# EAGLE design slink (EAGLE 5.11)

## Sheet 1 of 2
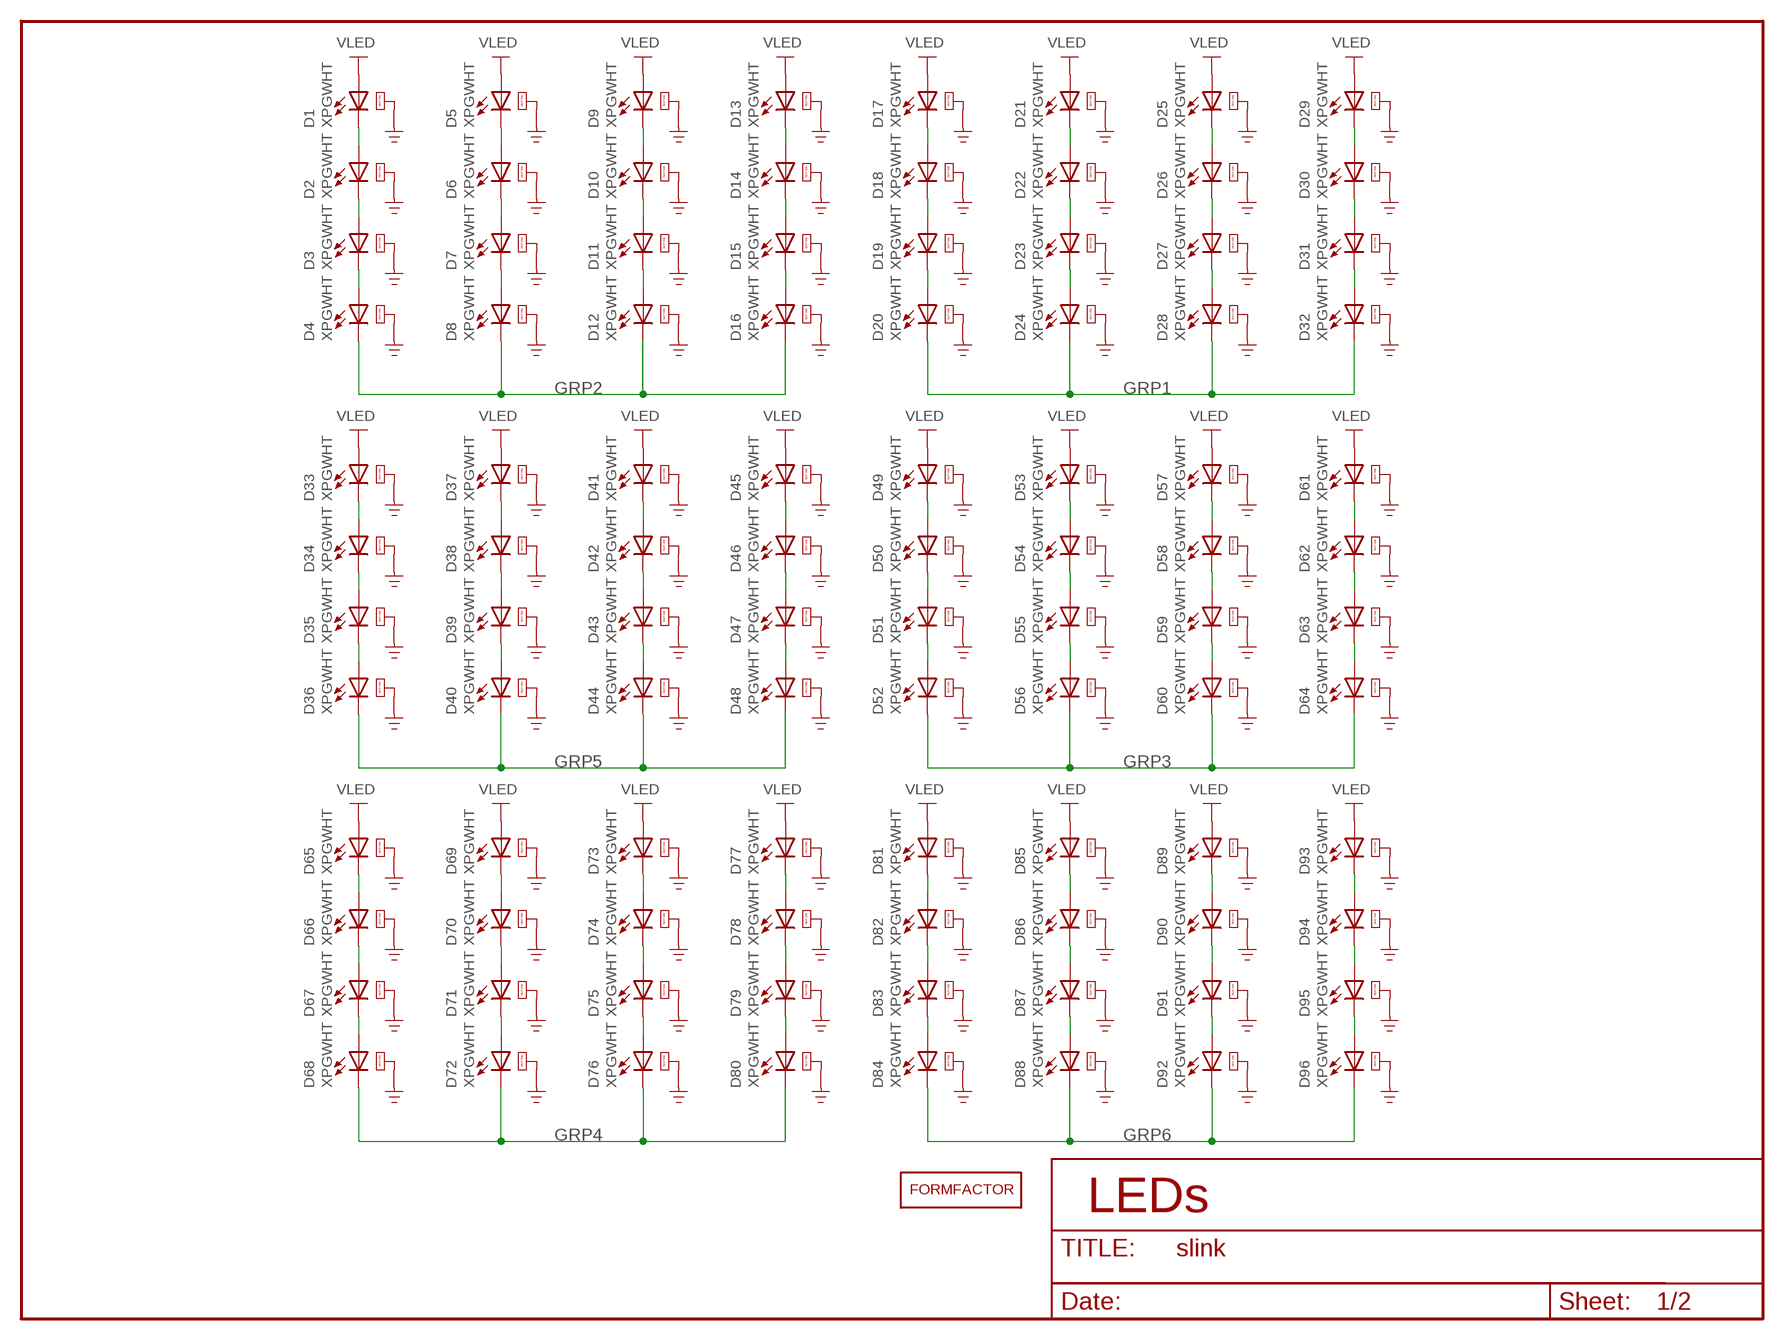
[diagram p0: schematic, sheet 1]

### Parts
D1  XPGWHT  [XLAMP_XP-G]
D2  XPGWHT  [XLAMP_XP-G]
D3  XPGWHT  [XLAMP_XP-G]
D4  XPGWHT  [XLAMP_XP-G]
D5  XPGWHT  [XLAMP_XP-G]
D6  XPGWHT  [XLAMP_XP-G]
D7  XPGWHT  [XLAMP_XP-G]
D8  XPGWHT  [XLAMP_XP-G]
D9  XPGWHT  [XLAMP_XP-G]
D10  XPGWHT  [XLAMP_XP-G]
D11  XPGWHT  [XLAMP_XP-G]
D12  XPGWHT  [XLAMP_XP-G]
D13  XPGWHT  [XLAMP_XP-G]
D14  XPGWHT  [XLAMP_XP-G]
D15  XPGWHT  [XLAMP_XP-G]
D16  XPGWHT  [XLAMP_XP-G]
D17  XPGWHT  [XLAMP_XP-G]
D18  XPGWHT  [XLAMP_XP-G]
D19  XPGWHT  [XLAMP_XP-G]
D20  XPGWHT  [XLAMP_XP-G]
D21  XPGWHT  [XLAMP_XP-G]
D22  XPGWHT  [XLAMP_XP-G]
D23  XPGWHT  [XLAMP_XP-G]
D24  XPGWHT  [XLAMP_XP-G]
D25  XPGWHT  [XLAMP_XP-G]
D26  XPGWHT  [XLAMP_XP-G]
D27  XPGWHT  [XLAMP_XP-G]
D28  XPGWHT  [XLAMP_XP-G]
D29  XPGWHT  [XLAMP_XP-G]
D30  XPGWHT  [XLAMP_XP-G]
D31  XPGWHT  [XLAMP_XP-G]
D32  XPGWHT  [XLAMP_XP-G]
D33  XPGWHT  [XLAMP_XP-G]
D34  XPGWHT  [XLAMP_XP-G]
D35  XPGWHT  [XLAMP_XP-G]
D36  XPGWHT  [XLAMP_XP-G]
D37  XPGWHT  [XLAMP_XP-G]
D38  XPGWHT  [XLAMP_XP-G]
D39  XPGWHT  [XLAMP_XP-G]
D40  XPGWHT  [XLAMP_XP-G]
D41  XPGWHT  [XLAMP_XP-G]
D42  XPGWHT  [XLAMP_XP-G]
D43  XPGWHT  [XLAMP_XP-G]
D44  XPGWHT  [XLAMP_XP-G]
D45  XPGWHT  [XLAMP_XP-G]
D46  XPGWHT  [XLAMP_XP-G]
D47  XPGWHT  [XLAMP_XP-G]
D48  XPGWHT  [XLAMP_XP-G]
D49  XPGWHT  [XLAMP_XP-G]
D50  XPGWHT  [XLAMP_XP-G]
D51  XPGWHT  [XLAMP_XP-G]
D52  XPGWHT  [XLAMP_XP-G]
D53  XPGWHT  [XLAMP_XP-G]
D54  XPGWHT  [XLAMP_XP-G]
D55  XPGWHT  [XLAMP_XP-G]
D56  XPGWHT  [XLAMP_XP-G]
D57  XPGWHT  [XLAMP_XP-G]
D58  XPGWHT  [XLAMP_XP-G]
D59  XPGWHT  [XLAMP_XP-G]
D60  XPGWHT  [XLAMP_XP-G]
D61  XPGWHT  [XLAMP_XP-G]
D62  XPGWHT  [XLAMP_XP-G]
D63  XPGWHT  [XLAMP_XP-G]
D64  XPGWHT  [XLAMP_XP-G]
D65  XPGWHT  [XLAMP_XP-G]
D66  XPGWHT  [XLAMP_XP-G]
D67  XPGWHT  [XLAMP_XP-G]
D68  XPGWHT  [XLAMP_XP-G]
D69  XPGWHT  [XLAMP_XP-G]
D70  XPGWHT  [XLAMP_XP-G]
D71  XPGWHT  [XLAMP_XP-G]
D72  XPGWHT  [XLAMP_XP-G]
D73  XPGWHT  [XLAMP_XP-G]
D74  XPGWHT  [XLAMP_XP-G]
D75  XPGWHT  [XLAMP_XP-G]
D76  XPGWHT  [XLAMP_XP-G]
D77  XPGWHT  [XLAMP_XP-G]
D78  XPGWHT  [XLAMP_XP-G]
D79  XPGWHT  [XLAMP_XP-G]
D80  XPGWHT  [XLAMP_XP-G]
D81  XPGWHT  [XLAMP_XP-G]
D82  XPGWHT  [XLAMP_XP-G]
D83  XPGWHT  [XLAMP_XP-G]
D84  XPGWHT  [XLAMP_XP-G]
D85  XPGWHT  [XLAMP_XP-G]
D86  XPGWHT  [XLAMP_XP-G]
D87  XPGWHT  [XLAMP_XP-G]
D88  XPGWHT  [XLAMP_XP-G]
D89  XPGWHT  [XLAMP_XP-G]
D90  XPGWHT  [XLAMP_XP-G]
D91  XPGWHT  [XLAMP_XP-G]
D92  XPGWHT  [XLAMP_XP-G]
D93  XPGWHT  [XLAMP_XP-G]
D94  XPGWHT  [XLAMP_XP-G]
D95  XPGWHT  [XLAMP_XP-G]
D96  XPGWHT  [XLAMP_XP-G]
FORMFACTOR1  FORMFACTOR  [SINGLECHANNELSTROBE]

### Nets
GND: D1.HEAT(HEATSINK) D2.HEAT(HEATSINK) D3.HEAT(HEATSINK) D4.HEAT(HEATSINK) D5.HEAT(HEATSINK) D6.HEAT(HEATSINK) D7.HEAT(HEATSINK) D8.HEAT(HEATSINK) D9.HEAT(HEATSINK) D10.HEAT(HEATSINK) D11.HEAT(HEATSINK) D12.HEAT(HEATSINK) D13.HEAT(HEATSINK) D14.HEAT(HEATSINK) D15.HEAT(HEATSINK) D16.HEAT(HEATSINK) D17.HEAT(HEATSINK) D18.HEAT(HEATSINK) D19.HEAT(HEATSINK) D20.HEAT(HEATSINK) D21.HEAT(HEATSINK) D22.HEAT(HEATSINK) D23.HEAT(HEATSINK) D24.HEAT(HEATSINK) D25.HEAT(HEATSINK) D26.HEAT(HEATSINK) D27.HEAT(HEATSINK) D28.HEAT(HEATSINK) D29.HEAT(HEATSINK) D30.HEAT(HEATSINK) D31.HEAT(HEATSINK) D32.HEAT(HEATSINK) D33.HEAT(HEATSINK) D34.HEAT(HEATSINK) D35.HEAT(HEATSINK) D36.HEAT(HEATSINK) D37.HEAT(HEATSINK) D38.HEAT(HEATSINK) D39.HEAT(HEATSINK) D40.HEAT(HEATSINK) D41.HEAT(HEATSINK) D42.HEAT(HEATSINK) D43.HEAT(HEATSINK) D44.HEAT(HEATSINK) D45.HEAT(HEATSINK) D46.HEAT(HEATSINK) D47.HEAT(HEATSINK) D48.HEAT(HEATSINK) D49.HEAT(HEATSINK) D50.HEAT(HEATSINK) D51.HEAT(HEATSINK) D52.HEAT(HEATSINK) D53.HEAT(HEATSINK) D54.HEAT(HEATSINK) D55.HEAT(HEATSINK) D56.HEAT(HEATSINK) D57.HEAT(HEATSINK) D58.HEAT(HEATSINK) D59.HEAT(HEATSINK) D60.HEAT(HEATSINK) D61.HEAT(HEATSINK) D62.HEAT(HEATSINK) D63.HEAT(HEATSINK) D64.HEAT(HEATSINK) D65.HEAT(HEATSINK) D66.HEAT(HEATSINK) D67.HEAT(HEATSINK) D68.HEAT(HEATSINK) D69.HEAT(HEATSINK) D70.HEAT(HEATSINK) D71.HEAT(HEATSINK) D72.HEAT(HEATSINK) D73.HEAT(HEATSINK) D74.HEAT(HEATSINK) D75.HEAT(HEATSINK) D76.HEAT(HEATSINK) D77.HEAT(HEATSINK) D78.HEAT(HEATSINK) D79.HEAT(HEATSINK) D80.HEAT(HEATSINK) D81.HEAT(HEATSINK) D82.HEAT(HEATSINK) D83.HEAT(HEATSINK) D84.HEAT(HEATSINK) D85.HEAT(HEATSINK) D86.HEAT(HEATSINK) D87.HEAT(HEATSINK) D88.HEAT(HEATSINK) D89.HEAT(HEATSINK) D90.HEAT(HEATSINK) D91.HEAT(HEATSINK) D92.HEAT(HEATSINK) D93.HEAT(HEATSINK) D94.HEAT(HEATSINK) D95.HEAT(HEATSINK) D96.HEAT(HEATSINK) ; also sheet 2
GRP1: D20.C D24.C D28.C D32.C ; also sheet 2
GRP2: D4.C D8.C D12.C D16.C ; also sheet 2
GRP3: D52.C D56.C D60.C D64.C ; also sheet 2
GRP4: D68.C D72.C D76.C D80.C ; also sheet 2
GRP5: D36.C D40.C D44.C D48.C ; also sheet 2
GRP6: D84.C D88.C D92.C D96.C ; also sheet 2
N$1: D1.C D2.A
N$2: D2.C D3.A
N$3: D3.C D4.A
N$4: D5.C D6.A
N$5: D6.C D7.A
N$6: D7.C D8.A
N$7: D9.C D10.A
N$8: D10.C D11.A
N$9: D11.C D12.A
N$10: D13.C D14.A
N$11: D14.C D15.A
N$12: D15.C D16.A
N$13: D17.C D18.A
N$14: D18.C D19.A
N$15: D19.C D20.A
N$16: D21.C D22.A
N$17: D22.C D23.A
N$18: D23.C D24.A
N$19: D25.C D26.A
N$20: D26.C D27.A
N$21: D27.C D28.A
N$22: D29.C D30.A
N$23: D30.C D31.A
N$24: D31.C D32.A
N$25: D33.C D34.A
N$26: D34.C D35.A
N$27: D35.C D36.A
N$28: D37.C D38.A
N$29: D38.C D39.A
N$30: D39.C D40.A
N$31: D41.C D42.A
N$32: D42.C D43.A
N$33: D43.C D44.A
N$34: D45.C D46.A
N$35: D46.C D47.A
N$36: D47.C D48.A
N$37: D49.C D50.A
N$38: D50.C D51.A
N$39: D51.C D52.A
N$40: D53.C D54.A
N$41: D54.C D55.A
N$42: D55.C D56.A
N$43: D57.C D58.A
N$44: D58.C D59.A
N$45: D59.C D60.A
N$46: D61.C D62.A
N$47: D62.C D63.A
N$48: D63.C D64.A
N$49: D65.C D66.A
N$50: D66.C D67.A
N$51: D67.C D68.A
N$52: D69.C D70.A
N$53: D70.C D71.A
N$54: D71.C D72.A
N$55: D73.C D74.A
N$56: D74.C D75.A
N$57: D75.C D76.A
N$58: D77.C D78.A
N$59: D78.C D79.A
N$60: D79.C D80.A
N$61: D81.C D82.A
N$62: D82.C D83.A
N$63: D83.C D84.A
N$64: D85.C D86.A
N$65: D86.C D87.A
N$66: D87.C D88.A
N$67: D89.C D90.A
N$68: D90.C D91.A
N$69: D91.C D92.A
N$70: D93.C D94.A
N$71: D94.C D95.A
N$72: D95.C D96.A
VLED: D1.A D5.A D9.A D13.A D17.A D21.A D25.A D29.A D33.A D37.A D41.A D45.A D49.A D53.A D57.A D61.A D65.A D69.A D73.A D77.A D81.A D85.A D89.A D93.A ; also sheet 2

### Notes on the sheet
- LEDs

## Sheet 2 of 2
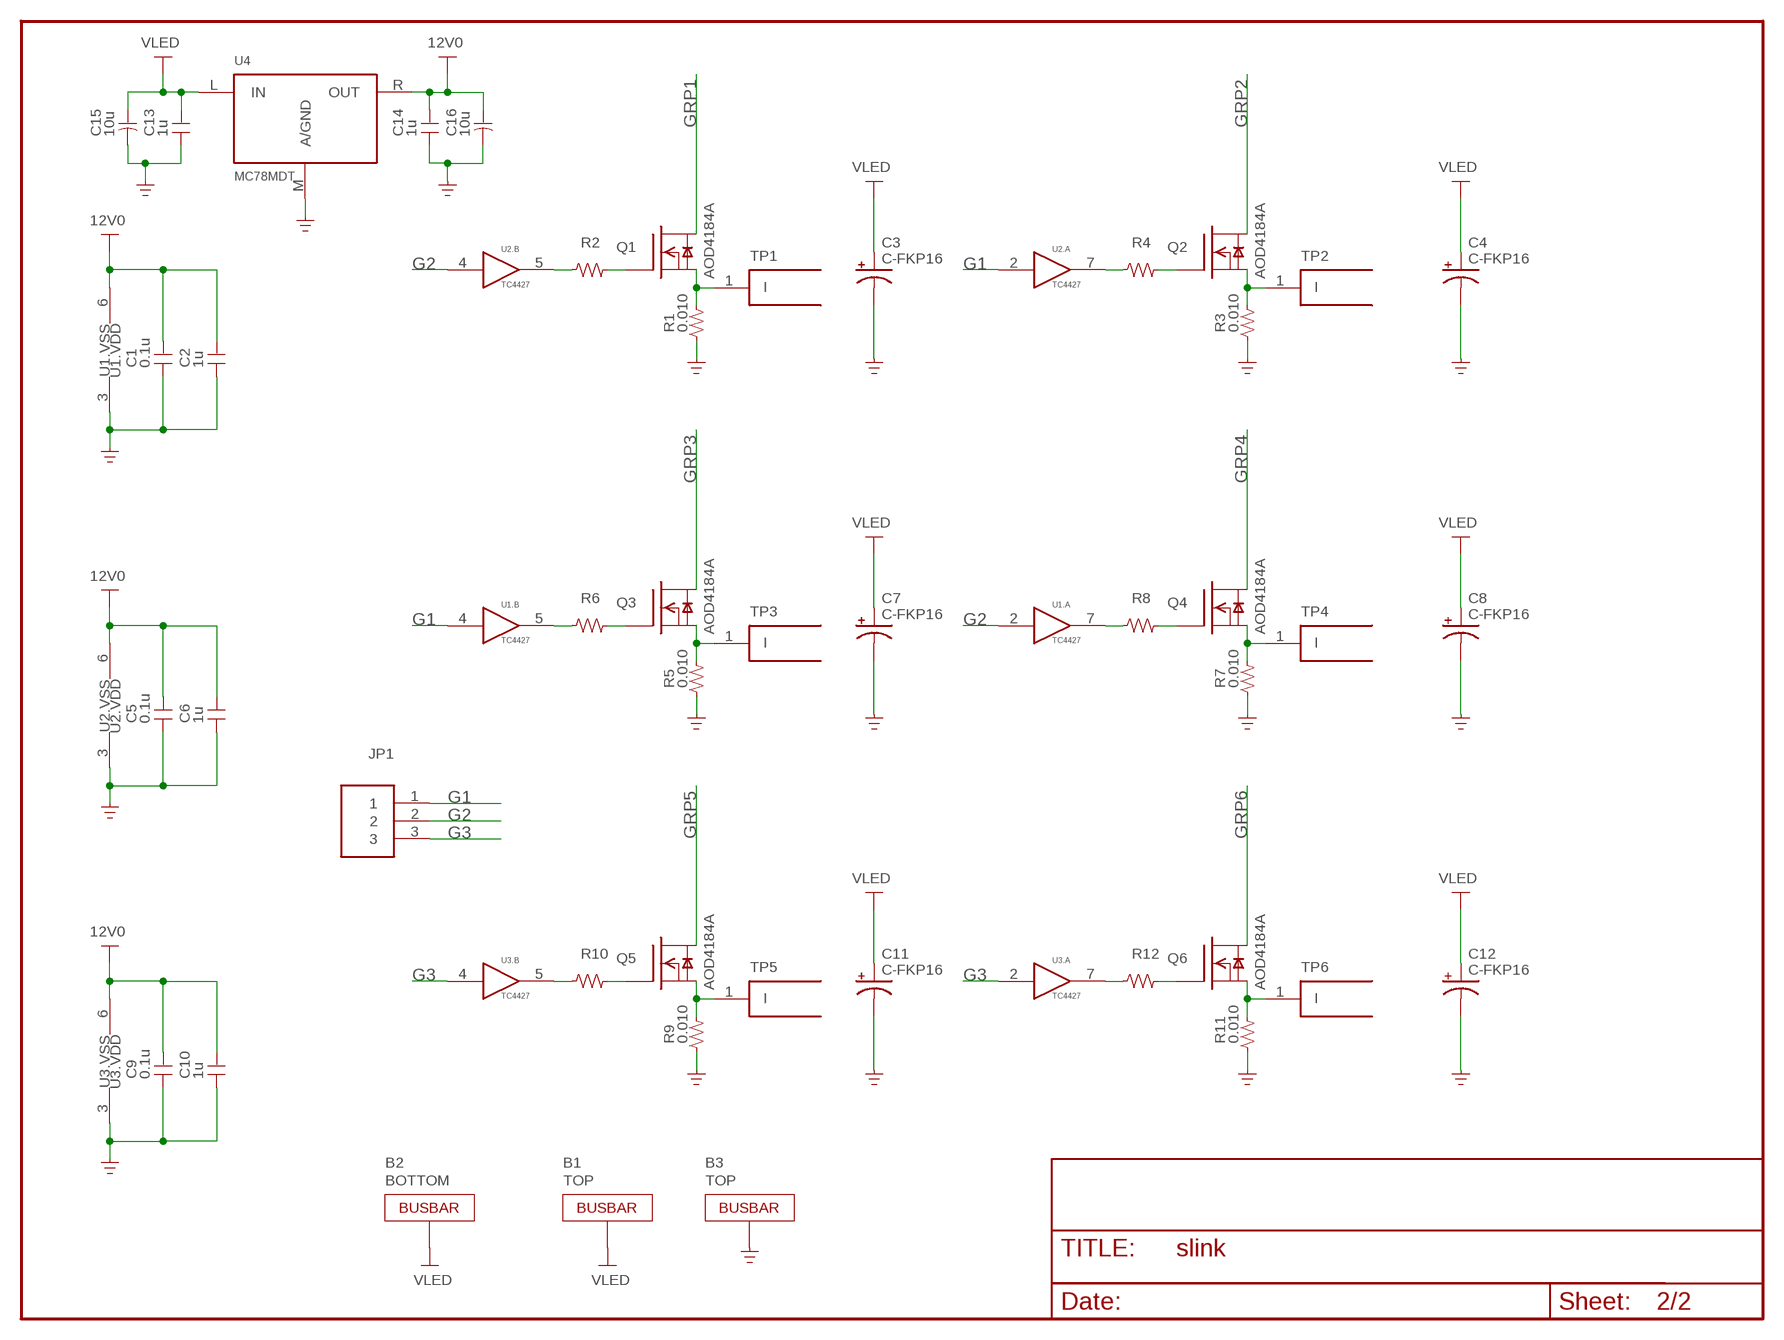
[diagram p1: schematic, sheet 2]

### Parts
B1  TOP  BUSBAR  [BUSBAR]
B2  BOTTOM  BUSBAR  [BUSBAR]
B3  TOP  BUSBAR-1LAYER  [BUSBAR-1LAYER]
C1  0.1u  C-0603  [SMD0603]
C2  1u  C-0603  [SMD0603]
C3  C-FKP16  [EEV-FK-P16]
C4  C-FKP16  [EEV-FK-P16]
C5  0.1u  C-0603  [SMD0603]
C6  1u  C-0603  [SMD0603]
C7  C-FKP16  [EEV-FK-P16]
C8  C-FKP16  [EEV-FK-P16]
C9  0.1u  C-0603  [SMD0603]
C10  1u  C-0603  [SMD0603]
C11  C-FKP16  [EEV-FK-P16]
C12  C-FKP16  [EEV-FK-P16]
C13  1u  C-0603  [SMD0603]
C14  1u  C-0603  [SMD0603]
C15  10u  C-POL-6032  [CT6032]
C16  10u  C-POL-6032  [CT6032]
JP1  CONN-3  [1X3]
Q1  AOD4184A  [TO252]
Q2  AOD4184A  [TO252]
Q3  AOD4184A  [TO252]
Q4  AOD4184A  [TO252]
Q5  AOD4184A  [TO252]
Q6  AOD4184A  [TO252]
R1  0.010  R-3.2X1.6MM  [3.2X1.6MM]
R2  R-0603  [SMD0603]
R3  0.010  R-3.2X1.6MM  [3.2X1.6MM]
R4  R-0603  [SMD0603]
R5  0.010  R-3.2X1.6MM  [3.2X1.6MM]
R6  R-0603  [SMD0603]
R7  0.010  R-3.2X1.6MM  [3.2X1.6MM]
R8  R-0603  [SMD0603]
R9  0.010  R-3.2X1.6MM  [3.2X1.6MM]
R10  R-0603  [SMD0603]
R11  0.010  R-3.2X1.6MM  [3.2X1.6MM]
R12  R-0603  [SMD0603]
TP1  I  TP-HOLE  [TP-HOLE]
TP2  I  TP-HOLE  [TP-HOLE]
TP3  I  TP-HOLE  [TP-HOLE]
TP4  I  TP-HOLE  [TP-HOLE]
TP5  I  TP-HOLE  [TP-HOLE]
TP6  I  TP-HOLE  [TP-HOLE]
U1  TC4427  [SOIC8]
U2  TC4427  [SOIC8]
U3  TC4427  [SOIC8]
U4  MC78MDT  [TO252]

### Nets
12V0: C1.2 C2.2 C5.2 C6.2 C9.2 C10.2 C14.2 C16.+ U1.6(.VDD:VDD) U2.6(.VDD:VDD) U3.6(.VDD:VDD) U4.R(OUT)
G1: JP1.1 U1.4(.B:I) U2.2(.A:I)
G2: JP1.2 U1.2(.A:I) U2.4(.B:I)
G3: JP1.3 U3.2(.A:I) U3.4(.B:I)
GND: B3.1 C1.1 C2.1 C3.1(-) C4.1(-) C5.1 C6.1 C7.1(-) C8.1(-) C9.1 C10.1 C11.1(-) C12.1(-) C13.1 C14.1 C15.- C16.- R1.1 R3.1 R5.1 R7.1 R9.1 R11.1 U1.3(.VSS:VSS) U2.3(.VSS:VSS) U3.3(.VSS:VSS) U4.M(A/GND) ; also sheet 1
GRP1: Q1.M(D) ; also sheet 1
GRP2: Q2.M(D) ; also sheet 1
GRP3: Q3.M(D) ; also sheet 1
GRP4: Q4.M(D) ; also sheet 1
GRP5: Q5.M(D) ; also sheet 1
GRP6: Q6.M(D) ; also sheet 1
N$73: Q1.R(S) R1.2 TP1.1
N$74: Q1.L(G) R2.2
N$75: R2.1 U2.5(.B:O)
N$79: Q2.R(S) R3.2 TP2.1
N$80: Q2.L(G) R4.2
N$81: R4.1 U2.7(.A:O)
N$85: Q3.R(S) R5.2 TP3.1
N$86: Q3.L(G) R6.2
N$87: R6.1 U1.5(.B:O)
N$91: Q4.R(S) R7.2 TP4.1
N$92: Q4.L(G) R8.2
N$93: R8.1 U1.7(.A:O)
N$97: Q5.R(S) R9.2 TP5.1
N$98: Q5.L(G) R10.2
N$99: R10.1 U3.5(.B:O)
N$103: Q6.R(S) R11.2 TP6.1
N$104: Q6.L(G) R12.2
N$105: R12.1 U3.7(.A:O)
VLED: B1.1 B2.1 C3.2(+) C4.2(+) C7.2(+) C8.2(+) C11.2(+) C12.2(+) C13.2 C15.+ U4.L(IN) ; also sheet 1
Unconnected: U1.1(NC) U1.8(NC) U2.1(NC) U2.8(NC) U3.1(NC) U3.8(NC)

## Library data of the parts
B1-B3 = parts:BUSBAR
C1 C2 C5 C6 C9 C10 C13 C14 = parts:C
C3 C4 C7 C8 C11 C12 = parts:C-
C15 C16 = parts:C-POL
D1-D96 = parts:XPGWHT
FORMFACTOR1 = parts-mar:FORMFACTOR
JP1 = parts:CONN-3
Q1-Q6 = parts:AOD4184A
R1-R12 = parts:R
TP1-TP6 = parts:TP
U1-U3 = parts:TC4427
U4 = parts:MC78M*

## Board
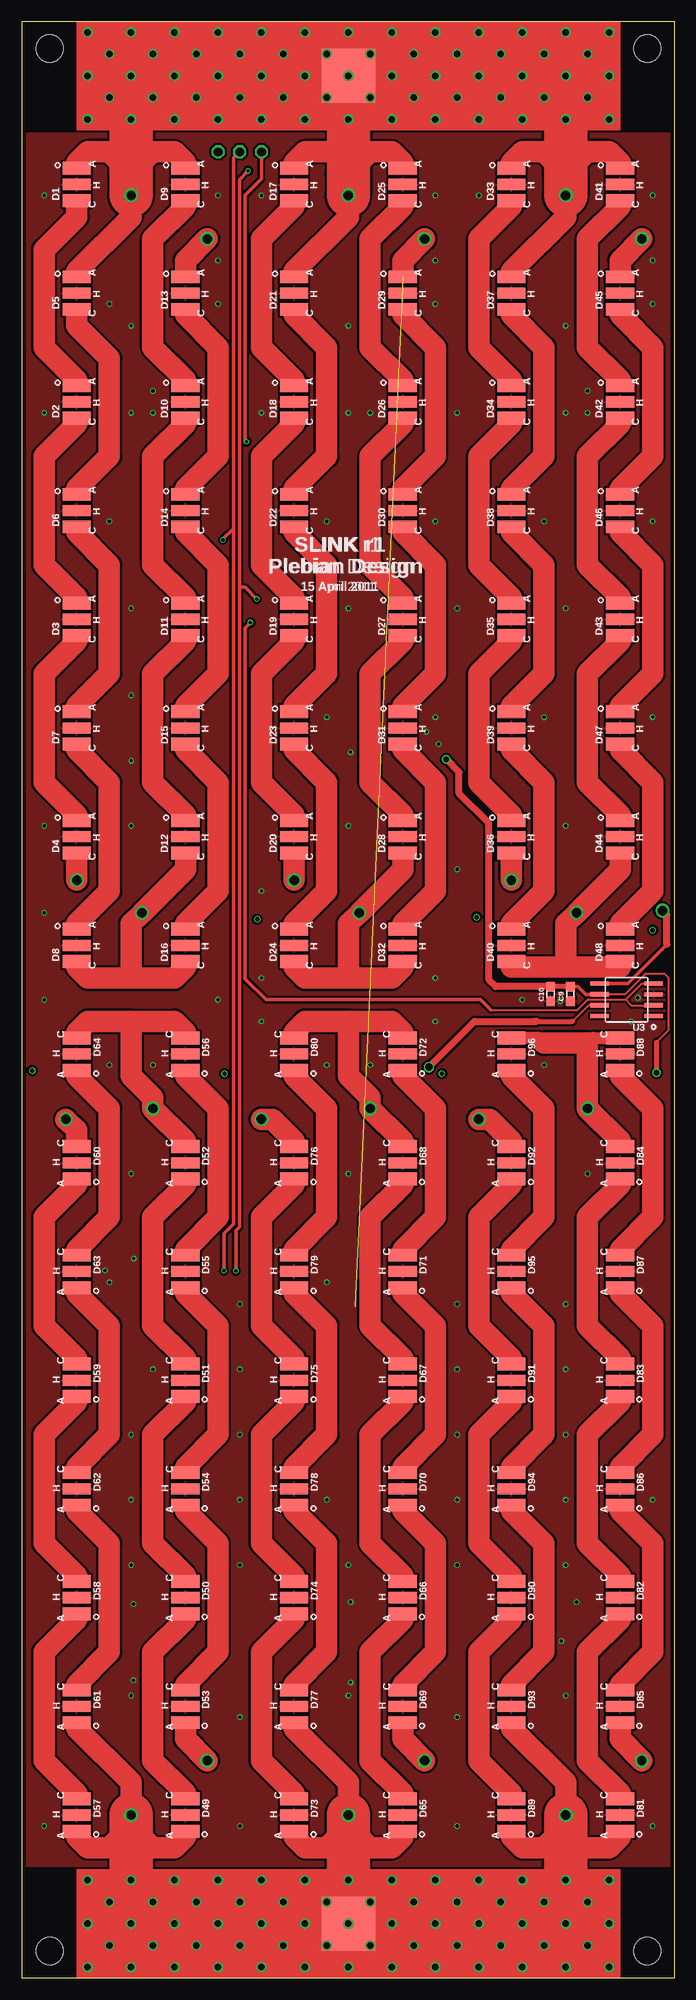
[diagram p2: board, top side]
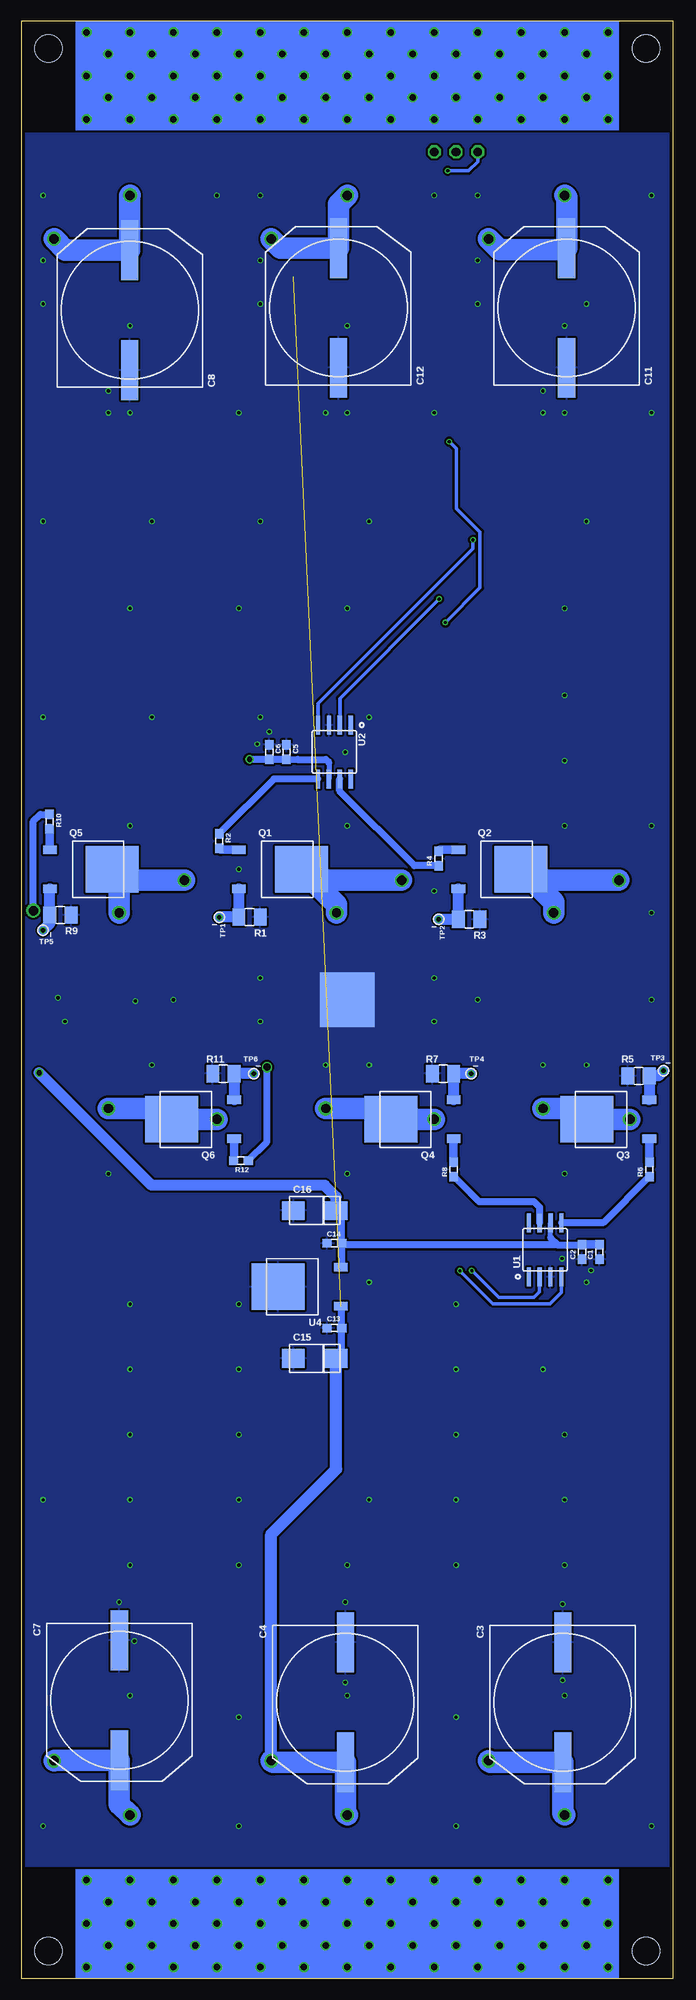
[diagram p3: board, bottom side, seen from below]

Size 76.2 x 228.6 mm. Coordinates in mm from the lower left corner, seen from the top.
Copper layers (1*16): Top 0.0356mm / dielectric 1.5011mm / Bottom 0.0356mm
Design rules "33each *": minimum track width 6mil, minimum drill 15mil, track to track 6mil, track to pad 6mil, pad to pad 6mil, via to via 6mil, smd to smd 6mil, copper to edge 15mil, drill to drill 10mil, minimum pad ring 5mil, minimum via ring 5mil, stop-mask expansion 4mil, vias tented up to drill 0mil, thermal gap 10mil

### Footprints (pad centres in the part's own frame; a part is rotated, then mirrored left to right if it is on the bottom)
BUSBAR = smd 6.35 x 6.35: 1 0,0 | drill 0.762 round: P$6 -30.48,0; P$7 -30.48,5.08; P$8 -30.48,-5.08; P$9 -27.94,2.54; P$10 -27.94,-2.54; P$11 -25.4,-5.08; P$12 -25.4,0; P$13 -25.4,5.08; P$14 -22.86,2.54; P$15 -22.86,-2.54; P$16 -20.32,5.08; P$17 -20.32,-5.08; P$18 -20.32,0; P$19 -17.78,2.54; P$20 -17.78,-2.54; P$21 -15.24,0; P$22 -15.24,5.08; P$23 -15.24,-5.08; P$24 -12.7,2.54; P$25 -12.7,-2.54; P$26 -10.16,-5.08; P$27 -10.16,0; P$28 -10.16,5.08; P$29 -7.62,2.54; P$30 -7.62,-2.54; P$31 -5.08,5.08; P$32 -5.08,-5.08; P$33 -5.08,0; P$34 -2.54,2.54; P$35 -2.54,-2.54; P$36 0,0; P$37 0,5.08; P$38 0,-5.08; P$39 2.54,2.54; P$40 2.54,-2.54; P$41 5.08,-5.08; P$42 5.08,0; P$43 5.08,5.08; P$44 7.62,2.54; P$45 7.62,-2.54; P$46 10.16,5.08; P$47 10.16,-5.08; P$48 10.16,0; P$49 12.7,2.54; P$50 12.7,-2.54; P$51 15.24,0; P$52 15.24,5.08; P$53 15.24,-5.08; P$54 17.78,2.54; P$55 17.78,-2.54; P$56 20.32,-5.08; P$57 20.32,0; P$58 20.32,5.08; P$59 22.86,2.54; P$60 22.86,-2.54; P$61 25.4,5.08; P$62 25.4,-5.08; P$63 25.4,0; P$64 27.94,2.54; P$65 27.94,-2.54; P$66 30.48,0; P$67 30.48,5.08; P$68 30.48,-5.08
BUSBAR-1LAYER = smd 6.35 x 6.35: 1 0,0
SMD0603 = smd 1.1 x 1: 1 -0.85,0; 2 0.85,0
EEV-FK-P16 = smd 7 x 2: 1 -10,-1.5; 2 4,-1.5
CT6032 = smd 2.6 x 2.2: + 2.5,0; - -2.5,0
XLAMP_XP-G = smd 1.5 x 3.3: A 1.898,0; C -1.898,0 | smd 1.3 x 3.3: HEAT 0,0
SINGLECHANNELSTROBE = hole 3.2: 3.175,-3.175; 73.025,-3.175; 3.175,-225.425; 73.025,-225.425
1X3 = drill 1.016 octagon: 1 0,2.54; 2 0,0; 3 0,-2.54
TO252 = smd 1 x 1.6: L -2.28,-4.8; R 2.28,-4.8 | smd 5.4 x 6.2: M 0,2.5
3.2X1.6MM = smd 1.5 x 2: 1 -1.25,0; 2 1.25,0
TP-HOLE = drill 0.508 round: 1 0,0
SOIC8 = smd 0.5 x 2.2: 1 -1.905,-3.154; 2 -0.645,-3.154; 3 0.625,-3.154; 4 1.895,-3.154; 5 1.905,3.154; 6 0.635,3.154; 7 -0.635,3.154; 8 -1.905,3.154

### Placement (x,y rotation side)
B1  38.1,222.25 0 top
B2  38.1,6.35 0 top
B3  38.1,114.3 0 bottom
C1  8.64,84.84 90 bottom
C2  10.67,84.84 90 bottom
C3  11.43,29.21 270 bottom
C4  36.83,29.21 270 bottom
C5  45.21,143.26 270 bottom
C6  47.24,143.26 270 bottom
C7  63.25,29.46 270 bottom
C8  65.02,197.87 90 bottom
C9  64.03,114.99 90 top
C10  61.72,114.99 90 top
C11  13.97,198.12 90 bottom
C12  40.64,198.12 90 bottom
C13  39.62,75.95 0 bottom
C14  39.62,85.85 0 bottom
C15  41.91,72.39 0 bottom
C16  41.91,89.66 0 bottom
D1  6.35,209.55 90 top
D2  6.35,184.15 90 top
D3  6.35,158.75 90 top
D4  6.35,133.35 90 top
D5  6.35,196.85 90 top
D6  6.35,171.45 90 top
D7  6.35,146.05 90 top
D8  6.35,120.65 90 top
D9  19.05,209.55 90 top
D10  19.05,184.15 90 top
D11  19.05,158.75 90 top
D12  19.05,133.35 90 top
D13  19.05,196.85 90 top
D14  19.05,171.45 90 top
D15  19.05,146.05 90 top
D16  19.05,120.65 90 top
D17  31.75,209.55 90 top
D18  31.75,184.15 90 top
D19  31.75,158.75 90 top
D20  31.75,133.35 90 top
D21  31.75,196.85 90 top
D22  31.75,171.45 90 top
D23  31.75,146.05 90 top
D24  31.75,120.65 90 top
D25  44.45,209.55 90 top
D26  44.45,184.15 90 top
D27  44.45,158.75 90 top
D28  44.45,133.35 90 top
D29  44.45,196.85 90 top
D30  44.45,171.45 90 top
D31  44.45,146.05 90 top
D32  44.45,120.65 90 top
D33  57.15,209.55 90 top
D34  57.15,184.15 90 top
D35  57.15,158.75 90 top
D36  57.15,133.35 90 top
D37  57.15,196.85 90 top
D38  57.15,171.45 90 top
D39  57.15,146.05 90 top
D40  57.15,120.65 90 top
D41  69.85,209.55 90 top
D42  69.85,184.15 90 top
D43  69.85,158.75 90 top
D44  69.85,133.35 90 top
D45  69.85,196.85 90 top
D46  69.85,171.45 90 top
D47  69.85,146.05 90 top
D48  69.85,120.65 90 top
D49  19.05,19.05 270 top
D50  19.05,44.45 270 top
D51  19.05,69.85 270 top
D52  19.05,95.25 270 top
D53  19.05,31.75 270 top
D54  19.05,57.15 270 top
D55  19.05,82.55 270 top
D56  19.05,107.95 270 top
D57  6.35,19.05 270 top
D58  6.35,44.45 270 top
D59  6.35,69.85 270 top
D60  6.35,95.25 270 top
D61  6.35,31.75 270 top
D62  6.35,57.15 270 top
D63  6.35,82.55 270 top
D64  6.35,107.95 270 top
D65  44.45,19.05 270 top
D66  44.45,44.45 270 top
D67  44.45,69.85 270 top
D68  44.45,95.25 270 top
D69  44.45,31.75 270 top
D70  44.45,57.15 270 top
D71  44.45,82.55 270 top
D72  44.45,107.95 270 top
D73  31.75,19.05 270 top
D74  31.75,44.45 270 top
D75  31.75,69.85 270 top
D76  31.75,95.25 270 top
D77  31.75,31.75 270 top
D78  31.75,57.15 270 top
D79  31.75,82.55 270 top
D80  31.75,107.95 270 top
D81  69.85,19.05 270 top
D82  69.85,44.45 270 top
D83  69.85,69.85 270 top
D84  69.85,95.25 270 top
D85  69.85,31.75 270 top
D86  69.85,57.15 270 top
D87  69.85,82.55 270 top
D88  69.85,107.95 270 top
D89  57.15,19.05 270 top
D90  57.15,44.45 270 top
D91  57.15,69.85 270 top
D92  57.15,95.25 270 top
D93  57.15,31.75 270 top
D94  57.15,57.15 270 top
D95  57.15,82.55 270 top
D96  57.15,107.95 270 top
FORMFACTOR1  0,228.6 0 top
JP1  25.4,213.36 90 top
Q1  45.97,129.54 270 bottom
Q2  20.32,129.54 270 bottom
Q3  7.62,100.33 90 bottom
Q4  30.48,100.33 90 bottom
Q5  68.07,129.54 270 bottom
Q6  56.13,100.33 90 bottom
R1  49.53,123.95 180 bottom
R2  53.09,132.84 270 bottom
R3  23.88,123.7 180 bottom
R4  27.43,130.81 90 bottom
R5  4.06,105.41 0 bottom
R6  2.79,94.49 90 bottom
R7  26.92,105.66 0 bottom
R8  25.65,94.49 90 bottom
R9  71.63,124.21 180 bottom
R10  72.9,135.13 270 bottom
R11  52.58,105.66 0 bottom
R12  50.55,95.5 180 bottom
TP1  53.09,123.95 270 bottom
TP2  27.43,123.7 270 bottom
TP3  1.14,106.02 90 bottom
TP4  23.62,105.66 90 bottom
TP5  73.66,122.43 0 bottom
TP6  49.02,105.66 90 bottom
U1  14.99,85.09 0 bottom
U2  39.62,143.26 180 bottom
U3  70.61,114.3 90 top
U4  43.69,80.77 90 bottom

### Tracks (layer width: path | path; a pad name or v marks a point on that pad's centre or on a via)
12V0  (via drill 0.64)
  Top 0.254: 74.12,109.35 75.51,110.74 75.51,116.87 75.06,117.32 72.77,117.32 70.38,114.94 U3.6
  Top 0.406: U3.6 65.84,114.94 64.92,115.85 64.05,115.85 C9.2
  Top 0.61: v74.12,105.77 74.12,109.35 | C9.2 C10.2
  Top 0.813: v49.53,142.39 51.03,140.89 51.03,138.41 54.51,134.93 54.51,123.34 54.53,123.32 54.53,116.61 55.31,115.84 C10.2
  Bottom 0.61: 40.26,141.99 U2.6 | 14.35,86.49 U1.6
  Bottom 0.813: 40.26,141.99 40.64,142.37 43.9,142.37 C5.2 C6.2 49.52,142.41 v49.53,142.39 | 13.46,85.6 14.35,86.49 | 13.46,85.6 9.74,85.6 9.65,85.69 | U4.R 38.77,83.17 C14.2 | C14.2 38.77,89.03 C16.+ | 38.79,85.67 13.61,85.67 13.54,85.6 13.46,85.6 | 38.79,85.67 38.79,85.7 | C14.2 38.77,85.69 38.79,85.67
  Bottom 1.016: C1.2 9.65,85.69 C2.2
  Bottom 1.27: C16.+ 39.41,91.28 40.74,92.61 60.96,92.61 v74.12,105.77
G1  (via drill 0.38)
  Top 0.406: v24.94,82.63 24.94,87.35 25.35,87.76 25.35,162.41 | v27.38,161.11 26.01,162.48 25.43,162.48 25.35,162.41 | 25.35,162.41 25.35,210.13 v26.36,211.15
  Bottom 0.406: U1.4 13.09,80.1 14.43,78.77 21.08,78.77 v24.94,82.63 | U2.2 38.98,149.51 v27.38,161.11 | v26.36,211.15 23.93,211.15 22.86,212.22 JP1.1
G2  (via drill 0.38)
  Top 0.406: v23.55,82.65 23.55,86.97 24.69,88.11 24.69,169.37 | v23.42,168.02 23.42,168.1 24.69,169.37 | 24.69,169.37 24.69,212.65 JP1.2
  Bottom 0.406: U1.2 15.63,80.15 16.28,79.5 20.4,79.5 v23.55,82.65 | U2.4 41.52,148.91 23.42,167 v23.42,168.02
G3  (via drill 0.38)
  Top 0.254: 54.76,113.11 64.87,113.11 66.06,114.3 70.51,114.3 | U3.4 72.41,116.2 70.51,114.3 | U3.2 71.16,113.66 70.51,114.3
  Top 0.406: 54.76,113.11 53.54,114.33 28.45,114.33 26.04,116.74 26.04,157.73 26.64,158.34 v26.64,158.37 | v26.19,179.5 26.01,179.68 26.01,208.31 27.94,210.24 JP1.3
  Bottom 0.406: v26.64,158.37 22.58,162.43 22.58,168.96 25.32,171.7 25.32,178.66 26.16,179.5 v26.19,179.5
GND  (via drill 0.38)
  other vias: 2.54,208.28 22.86,208.28 27.94,208.28 48.26,208.28 53.34,208.28 73.66,208.28 22.86,200.66 48.26,200.66 73.66,200.66 73.66,195.58 48.26,195.58 22.86,195.58 10.16,195.58 2.54,182.88 12.7,182.88 27.94,182.88 38.1,182.88 40.64,182.88 15.24,182.88 15.24,185.42 12.7,193.04 38.1,193.04 63.5,193.04 66.04,185.42 66.04,182.88 63.5,182.88 50.8,182.88 10.16,170.18 35.56,170.18 48.26,170.18 60.96,170.18 73.66,170.18 63.5,160.02 50.8,160.02 38.1,160.02 12.7,160.02 12.7,149.86 48.26,147.32 60.96,147.32 73.66,147.32 12.7,142.24 35.56,147.32 38.1,134.62 12.7,134.62 2.54,134.62 63.5,134.62 50.8,129.54 27.94,127 2.54,124.46 2.54,114.3 22.86,114.3 27.94,116.84 27.94,111.76 48.26,116.84 48.26,111.76 58.42,114.3 71.12,111.76 71.93,114.53 10.16,106.68 15.24,106.68 35.56,106.68 40.64,106.68 60.96,106.68 12.7,93.98 38.1,93.98 66.04,93.98 10.16,81.28 25.4,78.74 35.56,81.28 50.8,78.74 63.5,78.74 13,84.07 38.35,143.23 48.64,144.17 47.22,145.62 62.87,114.15 9.63,82.68 15.24,71.12 25.4,71.12 50.8,71.12 63.5,71.12 63.5,63.5 50.8,63.5 25.4,63.5 12.7,63.5 12.7,55.88 25.4,55.88 35.56,55.88 50.8,55.88 63.5,55.88 73.66,55.88 63.5,48.26 50.8,48.26 38.1,48.26 25.4,48.26 12.7,48.26 12.7,33.02 38.1,33.02 63.5,33.02 25.4,17.78 50.8,17.78 50.8,30.48 25.4,30.48 2.54,17.78 73.66,17.78 12.95,34.8 12.95,43.69 38.35,43.94 38.35,34.54 62.99,39.37 64.77,43.94
  pour Top (isolate 0.254): 0,0 76.2,0 76.2,228.6 0,228.6
  pour Bottom (isolate 0.254): 0,0 76.2,0 76.2,228.6 0,228.6
GRP1  (via drill 1.1)
  Top 1.27: 31.75,130.81 D20.C | D24.C 31.75,118.11 | 44.45,118.11 D32.C | 44.45,130.81 D28.C
  Top 2.54: v31.75,128.27 31.75,130.81 | 31.75,118.11 33.02,116.84 38.1,116.84 | 38.1,116.84 38.1,123.19 v39.37,124.46 44.45,129.54 44.45,130.81 | 44.45,118.11 43.18,116.84 38.1,116.84
  Bottom 2.54: v31.75,128.27 42.2,128.27 Q1.M 39.37,125.44 v39.37,124.46
GRP2  (via drill 1.1)
  Top 1.27: 6.35,130.81 D4.C | D8.C 6.35,118.11 | 19.05,118.11 D16.C | 19.05,130.81 D12.C
  Top 2.54: v6.35,128.27 6.35,130.81 | 6.35,118.11 7.62,116.84 12.7,116.84 | 12.7,116.84 12.7,123.19 v13.97,124.46 19.05,129.54 19.05,130.81 | 19.05,118.11 17.78,116.84 12.7,116.84
  Bottom 2.54: 16.51,128.27 v6.35,128.27 | 16.51,128.27 16.55,128.27 Q2.M | v13.97,124.46 13.97,125.73 16.51,128.27
GRP3  (via drill 1.1)
  Top 1.27: D60.C 6.35,97.79 | 6.35,110.49 D64.C | 19.05,110.49 D56.C | 19.05,97.79 D52.C
  Top 2.54: 19.05,97.79 v15.24,101.6 15.24,102.87 12.7,105.41 12.7,111.76 | 12.7,111.76 17.78,111.76 19.05,110.49 | 12.7,111.76 7.62,111.76 6.35,110.49 | 6.35,97.79 6.35,99.06 v5.08,100.33
  Bottom 2.54: v15.24,101.6 11.39,101.6 Q3.M v5.08,100.33
GRP4  (via drill 1.1)
  Top 1.27: 31.75,110.49 D80.C | 44.45,110.49 D72.C | D76.C 31.75,97.79 | 44.45,97.79 D68.C
  Top 2.54: 31.75,97.79 29.21,100.33 v27.94,100.33 | 44.45,97.79 v40.64,101.6 40.64,102.87 38.1,105.41 38.1,111.76 | 38.1,111.76 33.02,111.76 31.75,110.49 | 38.1,111.76 43.18,111.76 44.45,110.49
  Bottom 2.54: v27.94,100.33 Q4.M 34.25,101.6 v40.64,101.6
GRP5  (via drill 1.1)
  Top 1.27: 57.15,130.81 D36.C | D40.C 57.15,118.11 | 69.85,118.11 D48.C | 69.85,130.81 D44.C
  Top 2.54: v57.15,128.27 57.15,130.81 | 57.15,118.11 63.5,118.11 | 63.5,118.11 63.5,123.19 v64.77,124.46 69.85,129.54 69.85,130.81 | 63.5,118.11 69.85,118.11
  Bottom 2.54: v57.15,128.27 64.3,128.27 64.54,128.5 | 64.54,128.5 Q5.M | v64.77,124.46 64.77,128.27 64.54,128.5
GRP6  (via drill 1.1)
  Top 1.27: D92.C 57.15,97.79 | 69.85,97.79 D84.C
  Top 1.422: D88.C 66.67,109.85 66.04,109.22 | D96.C 60.33,109.85 60.96,109.22
  Top 2.54: 57.15,97.79 54.61,100.33 v53.34,100.33 | 69.85,97.79 v66.04,101.6 66.04,109.22 60.96,109.22
  Bottom 2.54: v53.34,100.33 Q6.M 59.9,101.6 v66.04,101.6
N$1
  Top 1.27: D2.A 6.35,186.69
  Top 1.422: 6.35,207.01 D1.C
  Top 2.54: 6.35,207.01 6.35,205.74 2.54,201.93 2.54,190.5 6.35,186.69
N$2
  Top 1.27: 6.35,181.61 D2.C | D3.A 6.35,161.29
  Top 2.54: 6.35,181.61 2.54,177.8 2.54,165.1 6.35,161.29
N$3
  Top 1.27: 6.35,156.21 D3.C | D4.A 6.35,135.89
  Top 2.54: 6.35,156.21 2.54,152.4 2.54,139.7 6.35,135.89
N$4
  Top 1.27: D6.A 6.35,173.99 | 6.35,194.31 D5.C
  Top 2.54: 6.35,173.99 10.16,177.8 10.16,189.23 6.35,193.04 6.35,194.31
N$5
  Top 1.27: 6.35,168.91 D6.C | D7.A 6.35,148.59
  Top 2.54: 6.35,168.91 10.16,165.1 10.16,152.4 6.35,148.59
N$6
  Top 1.27: 6.35,143.51 D7.C | D8.A 6.35,123.19
  Top 2.54: 6.35,143.51 10.16,139.7 10.16,127 6.35,123.19
N$7
  Top 1.27: 19.05,207.01 D9.C | D10.A 19.05,186.69
  Top 2.54: 19.05,207.01 15.24,203.2 15.24,190.5 19.05,186.69
N$8
  Top 1.27: 19.05,181.61 D10.C | D11.A 19.05,161.29
  Top 2.54: 19.05,181.61 15.24,177.8 15.24,165.1 19.05,161.29
N$9
  Top 1.27: 19.05,156.21 D11.C | D12.A 19.05,135.89
  Top 2.54: 19.05,156.21 15.24,152.4 15.24,139.7 19.05,135.89
N$10
  Top 1.27: 19.05,194.31 D13.C | D14.A 19.05,173.99
  Top 2.54: 19.05,194.31 22.86,190.5 22.86,177.8 19.05,173.99
N$11
  Top 1.27: 19.05,168.91 D14.C | D15.A 19.05,148.59
  Top 2.54: 19.05,168.91 22.86,165.1 22.86,152.4 19.05,148.59
N$12
  Top 1.27: 19.05,143.51 D15.C | D16.A 19.05,123.19
  Top 2.54: 19.05,143.51 22.86,139.7 22.86,127 19.05,123.19
N$13
  Top 1.27: 31.75,207.01 D17.C | D18.A 31.75,186.69
  Top 2.54: 31.75,207.01 27.94,203.2 27.94,190.5 31.75,186.69
N$14
  Top 1.27: 31.75,181.61 D18.C | D19.A 31.75,161.29
  Top 2.54: 31.75,181.61 27.94,177.8 27.94,165.1 31.75,161.29
N$15
  Top 1.27: 31.75,156.21 D19.C | D20.A 31.75,135.89
  Top 2.54: 31.75,156.21 27.94,152.4 27.94,139.7 31.75,135.89
N$16
  Top 1.27: 31.75,194.31 D21.C | D22.A 31.75,173.99
  Top 2.54: 31.75,194.31 35.56,190.5 35.56,177.8 31.75,173.99
N$17
  Top 1.27: 31.75,168.91 D22.C | D23.A 31.75,148.59
  Top 2.54: 31.75,168.91 35.56,165.1 35.56,152.4 31.75,148.59
N$18
  Top 1.27: 31.75,143.51 D23.C | D24.A 31.75,123.19
  Top 2.54: 31.75,143.51 35.56,139.7 35.56,127 31.75,123.19
N$19
  Top 1.27: 44.45,207.01 D25.C | D26.A 44.45,186.69
  Top 2.54: 44.45,207.01 40.64,203.2 40.64,190.5 44.45,186.69
N$20
  Top 1.27: 44.45,181.61 D26.C | D27.A 44.45,161.29
  Top 2.54: 44.45,181.61 40.64,177.8 40.64,165.1 44.45,161.29
N$21
  Top 1.27: 44.45,156.21 D27.C | D28.A 44.45,135.89
  Top 2.54: 44.45,156.21 40.64,152.4 40.64,139.7 44.45,135.89
N$22
  Top 1.27: 44.45,194.31 D29.C | D30.A 44.45,173.99
  Top 2.54: 44.45,194.31 48.26,190.5 48.26,177.8 44.45,173.99
N$23
  Top 1.27: 44.45,168.91 D30.C | D31.A 44.45,148.59
  Top 2.54: 44.45,168.91 48.26,165.1 48.26,152.4 44.45,148.59
N$24
  Top 1.27: 44.45,143.51 D31.C | D32.A 44.45,123.19
  Top 2.54: 44.45,143.51 48.26,139.7 48.26,127 44.45,123.19
N$25
  Top 1.27: 57.15,207.01 D33.C | D34.A 57.15,186.69
  Top 2.54: 57.15,207.01 53.34,203.2 53.34,190.5 57.15,186.69
N$26
  Top 1.27: 57.15,181.61 D34.C | D35.A 57.15,161.29
  Top 2.54: 57.15,181.61 53.34,177.8 53.34,165.1 57.15,161.29
N$27
  Top 1.27: 57.15,156.21 D35.C | D36.A 57.15,135.89
  Top 2.54: 57.15,156.21 53.34,152.4 53.34,139.7 57.15,135.89
N$28
  Top 1.27: 57.15,194.31 D37.C | D38.A 57.15,173.99
  Top 2.54: 57.15,194.31 60.96,190.5 60.96,177.8 57.15,173.99
N$29
  Top 1.27: 57.15,168.91 D38.C | D39.A 57.15,148.59
  Top 2.54: 57.15,168.91 60.96,165.1 60.96,152.4 57.15,148.59
N$30
  Top 1.27: 57.15,143.51 D39.C | D40.A 57.15,123.19
  Top 2.54: 57.15,143.51 60.96,139.7 60.96,127 57.15,123.19
N$31
  Top 1.27: 69.85,207.01 D41.C | D42.A 69.85,186.69
  Top 2.54: 69.85,207.01 66.04,203.2 66.04,190.5 69.85,186.69
N$32
  Top 1.27: 69.85,181.61 D42.C | D43.A 69.85,161.29
  Top 2.54: 69.85,181.61 66.04,177.8 66.04,165.1 69.85,161.29
N$33
  Top 1.27: 69.85,156.21 D43.C | D44.A 69.85,135.89
  Top 2.54: 69.85,156.21 66.04,152.4 66.04,139.7 69.85,135.89
N$34
  Top 1.27: 69.85,194.31 D45.C | D46.A 69.85,173.99
  Top 2.54: 69.85,194.31 73.66,190.5 73.66,177.8 69.85,173.99
N$35
  Top 1.27: 69.85,168.91 D46.C | D47.A 69.85,148.59
  Top 2.54: 69.85,168.91 73.66,165.1 73.66,152.4 69.85,148.59
N$36
  Top 1.27: 69.85,143.51 D47.C | D48.A 69.85,123.19
  Top 2.54: 69.85,143.51 73.66,139.7 73.66,127 69.85,123.19
N$37
  Top 1.27: D49.C 19.05,21.59 | 19.05,41.91 D50.A
  Top 2.54: 19.05,21.59 15.24,25.4 15.24,38.1 19.05,41.91
N$38
  Top 1.27: D50.C 19.05,46.99 | 19.05,67.31 D51.A
  Top 2.54: 19.05,46.99 15.24,50.8 15.24,63.5 19.05,67.31
N$39
  Top 1.27: D51.C 19.05,72.39 | 19.05,92.71 D52.A
  Top 2.54: 19.05,72.39 15.24,76.2 15.24,88.9 19.05,92.71
N$40
  Top 1.27: D53.C 19.05,34.29 | 19.05,54.61 D54.A
  Top 2.54: 19.05,34.29 22.86,38.1 22.86,50.8 19.05,54.61
N$41
  Top 1.27: D54.C 19.05,59.69 | 19.05,80.01 D55.A
  Top 2.54: 19.05,59.69 22.86,63.5 22.86,76.2 19.05,80.01
N$42
  Top 1.27: D55.C 19.05,85.09 | 19.05,105.41 D56.A
  Top 2.54: 19.05,85.09 22.86,88.9 22.86,101.6 19.05,105.41
N$43
  Top 1.27: D57.C 6.35,21.59 | 6.35,41.91 D58.A
  Top 2.54: 6.35,21.59 2.54,25.4 2.54,38.1 6.35,41.91
N$44
  Top 1.27: D58.C 6.35,46.99 | 6.35,67.31 D59.A
  Top 2.54: 6.35,46.99 2.54,50.8 2.54,63.5 6.35,67.31
N$45
  Top 1.27: D59.C 6.35,72.39 | 6.35,92.71 D60.A
  Top 2.54: 6.35,72.39 2.54,76.2 2.54,88.9 6.35,92.71
N$46
  Top 1.27: D61.C 6.35,34.29 | 6.35,54.61 D62.A
  Top 2.54: 6.35,34.29 10.16,38.1 10.16,50.8 6.35,54.61
N$47
  Top 1.27: D62.C 6.35,59.69 | 6.35,80.01 D63.A
  Top 2.54: 6.35,59.69 10.16,63.5 10.16,76.2 6.35,80.01
N$48
  Top 1.27: D63.C 6.35,85.09 | 6.35,105.41 D64.A
  Top 2.54: 6.35,85.09 10.16,88.9 10.16,101.6 6.35,105.41
N$49
  Top 1.27: D65.C 44.45,21.59 | 44.45,41.91 D66.A
  Top 2.54: 44.45,21.59 40.64,25.4 40.64,38.1 44.45,41.91
N$50
  Top 1.27: D66.C 44.45,46.99 | 44.45,67.31 D67.A
  Top 2.54: 44.45,46.99 40.64,50.8 40.64,63.5 44.45,67.31
N$51
  Top 1.27: D67.C 44.45,72.39 | 44.45,92.71 D68.A
  Top 2.54: 44.45,72.39 40.64,76.2 40.64,88.9 44.45,92.71
N$52
  Top 1.27: D69.C 44.45,34.29 | 44.45,54.61 D70.A
  Top 2.54: 44.45,34.29 48.26,38.1 48.26,50.8 44.45,54.61
N$53
  Top 1.27: D70.C 44.45,59.69 | 44.45,80.01 D71.A
  Top 2.54: 44.45,59.69 48.26,63.5 48.26,76.2 44.45,80.01
N$54
  Top 1.27: D71.C 44.45,85.09 | 44.45,105.41 D72.A
  Top 2.54: 44.45,85.09 48.26,88.9 48.26,101.6 44.45,105.41
N$55
  Top 1.27: D73.C 31.75,21.59 | 31.75,41.91 D74.A
  Top 2.54: 31.75,21.59 27.94,25.4 27.94,38.1 31.75,41.91
N$56
  Top 1.27: D74.C 31.75,46.99 | 31.75,67.31 D75.A
  Top 2.54: 31.75,46.99 27.94,50.8 27.94,63.5 31.75,67.31
N$57
  Top 1.27: D75.C 31.75,72.39 | 31.75,92.71 D76.A
  Top 2.54: 31.75,72.39 27.94,76.2 27.94,88.9 31.75,92.71
N$58
  Top 1.27: D77.C 31.75,34.29 | 31.75,54.61 D78.A
  Top 2.54: 31.75,34.29 35.56,38.1 35.56,50.8 31.75,54.61
N$59
  Top 1.27: D78.C 31.75,59.69 | 31.75,80.01 D79.A
  Top 2.54: 31.75,59.69 35.56,63.5 35.56,76.2 31.75,80.01
N$60
  Top 1.27: D79.C 31.75,85.09 | 31.75,105.41 D80.A
  Top 2.54: 31.75,85.09 35.56,88.9 35.56,101.6 31.75,105.41
N$61
  Top 1.27: D81.C 69.85,21.59 | 69.85,41.91 D82.A
  Top 2.54: 69.85,21.59 66.04,25.4 66.04,38.1 69.85,41.91
N$62
  Top 1.27: D82.C 69.85,46.99 | 69.85,67.31 D83.A
  Top 2.54: 69.85,46.99 66.04,50.8 66.04,63.5 69.85,67.31
N$63
  Top 1.27: D83.C 69.85,72.39 | 69.85,92.71 D84.A
  Top 2.54: 69.85,72.39 66.04,76.2 66.04,88.9 69.85,92.71
N$64
  Top 1.27: D85.C 69.85,34.29 | 69.85,54.61 D86.A
  Top 2.54: 69.85,34.29 73.66,38.1 73.66,50.8 69.85,54.61
N$65
  Top 1.27: D86.C 69.85,59.69 | 69.85,80.01 D87.A
  Top 2.54: 69.85,59.69 73.66,63.5 73.66,76.2 69.85,80.01
N$66
  Top 1.27: D87.C 69.85,85.09 | 69.85,105.41 D88.A
  Top 2.54: 69.85,85.09 73.66,88.9 73.66,101.6 69.85,105.41
N$67
  Top 1.27: D89.C 57.15,21.59 | 57.15,41.91 D90.A
  Top 2.54: 57.15,21.59 53.34,25.4 53.34,38.1 57.15,41.91
N$68
  Top 1.27: D90.C 57.15,46.99 | 57.15,67.31 D91.A
  Top 2.54: 57.15,46.99 53.34,50.8 53.34,63.5 57.15,67.31
N$69
  Top 1.27: D91.C 57.15,72.39 | 57.15,92.71 D92.A
  Top 2.54: 57.15,72.39 53.34,76.2 53.34,88.9 57.15,92.71
N$70
  Top 1.27: D93.C 57.15,34.29 | 57.15,54.61 D94.A
  Top 2.54: 57.15,34.29 60.96,38.1 60.96,50.8 57.15,54.61
N$71
  Top 1.27: D94.C 57.15,59.69 | 57.15,80.01 D95.A
  Top 2.54: 57.15,59.69 60.96,63.5 60.96,76.2 57.15,80.01
N$72
  Top 1.27: D95.C 57.15,85.09 | 57.15,105.41 D96.A
  Top 2.54: 57.15,85.09 60.96,88.9 60.96,101.6 57.15,105.41
N$73
  Bottom 1.27: TP1.1 R1.2 Q1.R
N$74
  Bottom 1.016: Q1.L 52.91,131.82 R2.2
N$75
  Bottom 0.813: U2.5 46.68,140.1 R2.1
N$79
  Bottom 1.27: TP2.1 R3.2 Q2.R
N$80
  Bottom 1.016: Q2.L 27.27,131.82 R4.2
N$81
  Bottom 0.813: R4.1 30.27,129.96 38.99,138.68 U2.7
N$85
  Bottom 1.27: Q3.R R5.2 1.75,105.41 TP3.1
N$86
  Bottom 1.016: Q3.L 2.82,95.36 R6.2
N$87
  Bottom 0.813: U1.5 8.19,88.24 R6.1
N$91
  Bottom 1.27: Q4.R R7.2 TP4.1
N$92
  Bottom 1.016: Q4.L 25.68,95.36 R8.2
N$93
  Bottom 0.813: U1.7 15.62,90.04 16.26,90.68 22.69,90.68 R8.1
N$97
  Bottom 1.27: TP5.1 72.88,123.21 R9.2 Q5.R
N$98
  Bottom 1.016: R10.2 72.9,131.85 Q5.L
N$99  (via drill 1.1)
  Top 0.406: U3.5 70.74,116.21 75.31,120.78
  Top 0.813: 75.31,120.78 75.31,124.21 v74.8,124.71
  Bottom 0.813: v74.8,124.71 74.8,135.15 73.99,135.97 72.91,135.97 R10.1
N$103
  Bottom 1.27: Q6.R R11.2 TP6.1
N$104
  Bottom 1.016: Q6.L 51.33,95.57 R12.2
N$105  (via drill 0.8)
  Top 0.254: U3.7 66.19,113.67 64.29,111.76
  Top 0.61: 59.79,111.76 64.29,111.76
  Top 0.813: 60.07,111.76 59.79,111.76 52.83,111.76 v47.5,106.43
  Bottom 0.813: v47.5,106.43 47.5,97.7 R12.1
VLED  (via drill 1.1)  (1 unrouted)
  Top 1.27: 19.05,199.39 D13.A | 6.35,212.09 D1.A | 19.05,212.09 D9.A | 6.35,199.39 D5.A | 31.75,199.39 D21.A | 31.75,212.09 D17.A | 44.45,212.09 D25.A | 44.45,199.39 D29.A | 57.15,199.39 D37.A | 69.85,199.39 D45.A | D41.A 69.85,212.09 | 57.15,212.09 D33.A | 6.35,16.51 D57.A | 19.05,16.51 D49.A | 31.75,16.51 D73.A | 44.45,16.51 D65.A | 57.15,16.51 D89.A | 57.15,29.21 D93.A | 69.85,29.21 D85.A | 44.45,29.21 D69.A | 31.75,29.21 D77.A | 19.05,29.21 D53.A | 6.35,29.21 D61.A | 69.85,16.51 D81.A
  Top 2.54: 6.35,212.09 7.62,213.36 10.16,213.36 12.7,210.82 15.24,213.36 17.78,213.36 19.05,212.09 | 31.75,212.09 33.02,213.36 36.83,213.36 38.1,210.82 40.64,213.36 43.18,213.36 44.45,212.09 | 57.15,212.09 58.42,213.36 60.96,213.36 63.5,210.82 66.04,213.36 68.58,213.36 69.85,212.09 | 6.35,199.39 12.7,205.74 v12.7,208.28 | 31.75,199.39 38.1,205.74 v38.1,208.28 | 57.15,199.39 63.5,205.74 v63.5,208.28 | 19.05,199.39 19.05,200.66 v21.59,203.2 | 44.45,199.39 44.45,200.66 v46.99,203.2 | 69.85,199.39 69.85,200.66 v72.39,203.2 | 6.35,16.51 7.62,15.24 10.16,15.24 12.7,17.78 15.24,15.24 17.78,15.24 19.05,16.51 | 31.75,16.51 33.02,15.24 35.56,15.24 38.1,17.78 40.64,15.24 43.18,15.24 44.45,16.51 | 57.15,16.51 58.42,15.24 60.96,15.24 63.5,17.78 v63.5,19.05 63.5,22.86 57.15,29.21 | 69.85,16.51 68.58,15.24 64.77,15.24 63.5,16.51 | 6.35,29.21 12.7,22.86 v12.7,19.05 | 31.75,29.21 38.1,22.86 v38.1,19.05 | 19.05,29.21 19.05,27.94 v21.59,25.4 | 44.45,29.21 44.45,27.94 v46.99,25.4 | 69.85,29.21 69.85,27.94 v72.39,25.4
  Top 5.08: v12.7,208.28 12.7,210.82 12.7,220.98 36.83,220.98 B1.1 | v38.1,208.28 38.1,210.82 B1.1 | v63.5,208.28 63.5,210.82 63.5,222.25 B1.1 | v12.7,19.05 12.7,17.78 12.7,6.35 B2.1 | B2.1 38.1,17.78 v38.1,19.05 | v63.5,19.05 63.5,16.51 63.5,6.35 B2.1
  Bottom 0.813: U4.L 38.77,78.38 C13.2 38.77,73.03 C15.+
  Bottom 1.422: C15.+ 39.41,59.45 46.99,51.87 v46.99,25.4
  Bottom 2.54: v21.59,203.2 20.32,201.93 12.66,201.93 C11.2 12.47,208.05 v12.7,208.28 | v46.99,203.2 45.91,202.12 C12.2 39.14,207.24 v38.1,208.28 | v72.39,203.2 71.06,201.87 C8.2 63.52,208.26 v63.5,208.28 | v12.7,19.05 12.93,19.28 C3.2 21.4,25.21 v21.59,25.4 | v38.1,19.05 38.33,19.28 C4.2 46.8,25.21 v46.99,25.4 | v63.5,19.05 64.75,20.3 C7.2 72.33,25.46 v72.39,25.4

### Text on the board
tPlace: SLINK r1 | Plebian Design | 15 April 2011
_tplace: D1 | D9 | D17 | D25 | D33 | D41 | D5 | D13 | D21 | D29 | D37 | D45 | D2 | D10 | D18 | D26 | D34 | D42 | D6 | D14 | D22 | D30 | D38 | D46 | SLINK r1 | Plebian Design | 15 April 2011 | D3 | D11 | D19 | D27 | D35 | D43 | D7 | D15 | D23 | D31 | D39 | D47 | D4 | D12 | D20 | D28 | D36 | D44 | D8 | D16 | D24 | D32 | D40 | D48 | D64 | D56 | D80 | D72 | D96 | D88 | D60 | D52 | D76 | D68 | D92 | D84 | D63 | D55 | D79 | D71 | D95 | D87 | D59 | D51 | D75 | D67 | D91 | D83 | D62 | D54 | D78 | D70 | D94 | D86 | D58 | D50 | D74 | D66 | D90 | D82 | D61 | D53 | D77 | D69 | D93 | D85 | D57 | D49 | D73 | D65 | D89 | D81
_bplace: TP2 | I | TP1 | I | I | TP5 | TP3 | TP4 | TP6 | I | I | I
_tnames: A | A | A | A | A | A | H | H | H | H | H | H | C | C | C | C | C | C | A | A | A | A | A | A | H | H | H | H | H | H | C | C | C | C | C | C | A | A | A | A | A | A | H | H | H | H | H | H | C | C | C | C | C | C | A | A | A | A | A | A | H | H | H | H | H | H | C | C | C | C | C | C | A | A | A | A | A | A | H | H | H | H | H | H | C | C | C | C | C | C | A | A | A | A | A | A | H | H | H | H | H | H | C | C | C | C | C | C | A | A | A | A | A | A | H | H | H | H | H | H | C | C | C | C | C | C | A | A | A | A | A | A | H | H | H | H | H | H | C | C | C | C | C | C | C10 | C9 | U3 | C | C | C | C | C | C | H | H | H | H | H | H | A | A | A | A | A | A | C | C | C | C | C | C | H | H | H | H | H | H | A | A | A | A | A | A | C | C | C | C | C | C | H | H | H | H | H | H | A | A | A | A | A | A | C | C | C | C | C | C | H | H | H | H | H | H | A | A | A | A | A | A | C | C | C | C | C | C | H | H | H | H | H | H | A | A | A | A | A | A | C | C | C | C | C | C | H | H | H | H | H | H | A | A | A | A | A | A | C | C | C | C | C | C | H | H | H | H | H | H | A | A | A | A | A | A | C | C | C | C | C | C | H | H | H | H | H | H | A | A | A | A | A | A
_bnames: C11 | C12 | C8 | U2 | C5 | C6 | R10 | Q2 | Q1 | R2 | Q5 | R4 | R3 | R1 | R9 | R5 | R7 | R11 | Q3 | Q4 | Q6 | R12 | R6 | R8 | C16 | C14 | C1 | C2 | U1 | U4 | C13 | C15 | C3 | C4 | C7